# Altium schematic sheet MCU.SchDoc: Bluetooth Gateway
size A; CheckedBy: QUOCTHANG; DrawnBy: DONGKHOA; Revision: V1.0.0; SheetNumber: 6; SheetTotal: 10
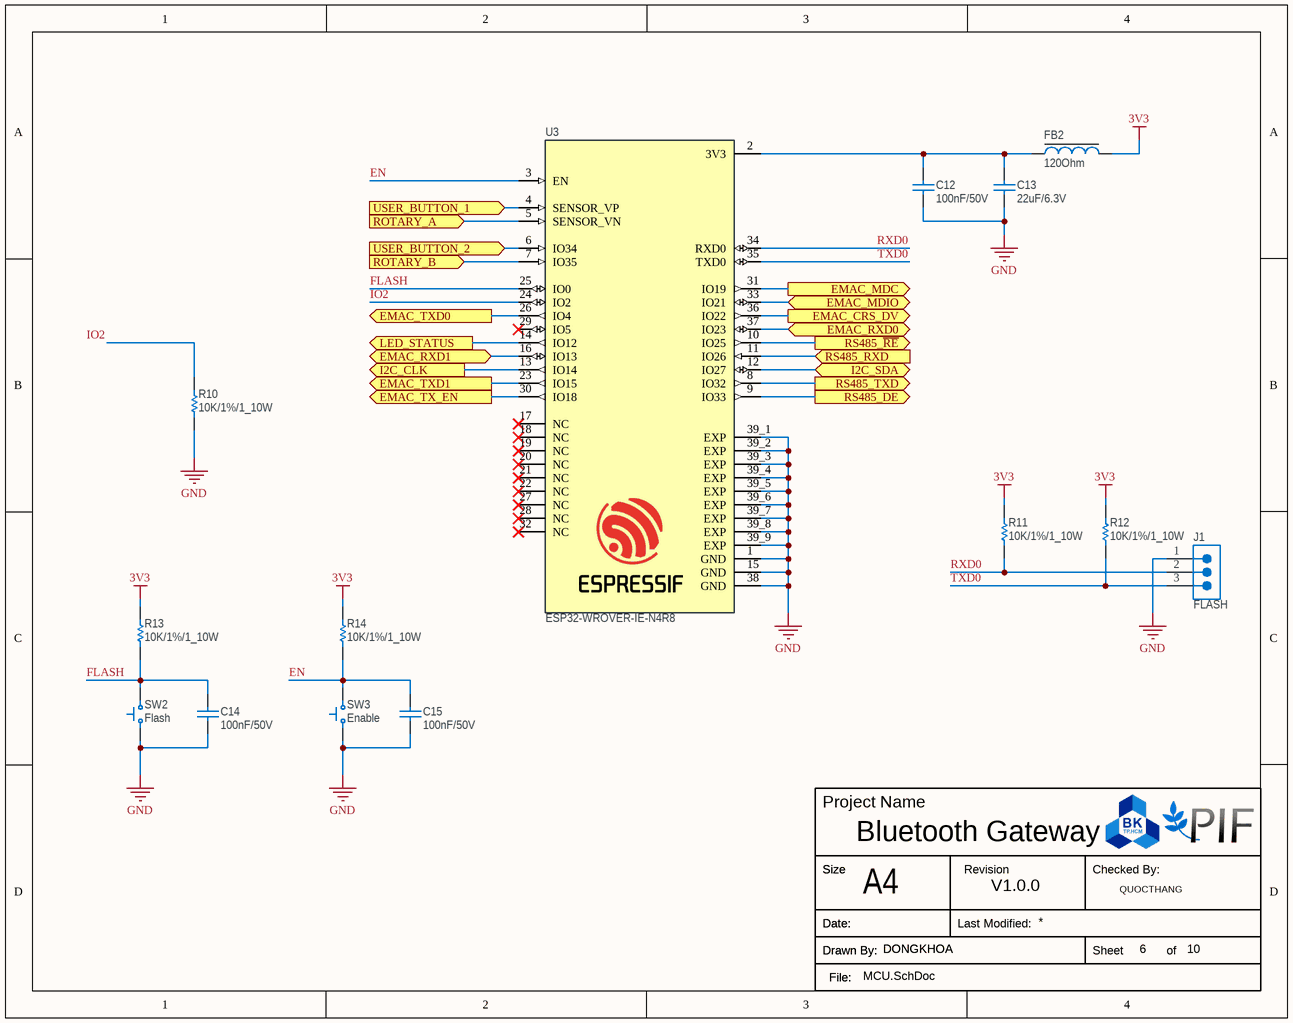
[diagram p0: MCU.SchDoc]

## Parts
C12  100nF/50V  [CAP_0805]
C13  22uF/6.3V  [CAP_0805]
C14  100nF/50V  [CAP_0603]
C15  100nF/50V  [CAP_0603]
FB2  120Ohm  [Ferrite_Bead_0805]
J1  FLASH  [Header_2.54mm_3P]
R10  10K/1%/1_10W  [Resistor_0603]
R11  10K/1%/1_10W  [Resistor_0603]
R12  10K/1%/1_10W  [Resistor_0603]
R13  10K/1%/1_10W  [Resistor_0603]
R14  10K/1%/1_10W  [Resistor_0603]
SW2  Flash  [Button_3x4mm_SMD_2P]
SW3  Enable  [Button_3x4mm_SMD_2P]
U3  ESP32-WROVER-IE-N4R8  [XCVR_ESP32-WROVER-IE-N4R8]

## Ports
EMAC_CRS_DV (out, see Overview_Schematic[5B], Ethernet[7B]), EMAC_MDC (out, see Overview_Schematic[5B], Ethernet[7B]), EMAC_MDIO (bidir, see Overview_Schematic[5B], Ethernet[7B]), EMAC_RXD0 (bidir, see Overview_Schematic[5B], Ethernet[7A]), EMAC_RXD1 (bidir, see Overview_Schematic[5B], Ethernet[7A]), EMAC_TX_EN (out, see Overview_Schematic[5B], Ethernet[7A]), EMAC_TXD0 (out, see Overview_Schematic[5B], Ethernet[7A]), EMAC_TXD1 (out, see Overview_Schematic[5B], Ethernet[7A]), I2C_CLK (out, see Overview_Schematic[4B], Display[2C]), I2C_SDA (bidir, see Overview_Schematic[4B], Display[2C]), LED_STATUS (out, see Overview_Schematic[4C], Interface[2B]), ROTARY_A (in, see Overview_Schematic[4C], Interface[1A]), ROTARY_B (in, see Overview_Schematic[4C], Interface[1A]), RS485_DE (out, see Overview_Schematic[5C], UART_RS485[1B]), RS485_RXD (in, see Overview_Schematic[5C], UART_RS485[1B]), RS485_TXD (out, see Overview_Schematic[5C], UART_RS485[1B]), RS485_~{RE} (out, see Overview_Schematic[5C], UART_RS485[1B]), USER_BUTTON_1 (in, see Overview_Schematic[4C], Interface[3A]), USER_BUTTON_2 (in, see Overview_Schematic[4C], Interface[2A])

## Nets
3V3: FB2.2 R11.2 R12.2 R13.2 R14.2
GND: C12.1 C13.1 C14.1 C15.1 J1.1 R10.1 SW2.1 SW3.1 U3.1(GND) U3.15(GND) U3.38(GND) U3.39_1(EXP) U3.39_2(EXP) U3.39_3(EXP) U3.39_4(EXP) U3.39_5(EXP) U3.39_6(EXP) U3.39_7(EXP) U3.39_8(EXP) U3.39_9(EXP)
EMAC_CRS_DV: U3.36(IO22) ; port EMAC_CRS_DV
EMAC_MDC: U3.31(IO19) ; port EMAC_MDC
EMAC_MDIO: U3.33(IO21) ; port EMAC_MDIO
EMAC_RXD0: U3.37(IO23) ; port EMAC_RXD0
EMAC_RXD1: U3.16(IO13) ; port EMAC_RXD1
EMAC_TX_EN: U3.30(IO18) ; port EMAC_TX_EN
EMAC_TXD0: U3.26(IO4) ; port EMAC_TXD0
EMAC_TXD1: U3.23(IO15) ; port EMAC_TXD1
EN: C15.2 R14.1 SW3.2 U3.3(EN)
FLASH: C14.2 R13.1 SW2.2 U3.25(IO0)
I2C_CLK: U3.13(IO14) ; port I2C_CLK
I2C_SDA: U3.12(IO27) ; port I2C_SDA
IO2: R10.2 U3.24(IO2)
LED_STATUS: U3.14(IO12) ; port LED_STATUS
ROTARY_A: U3.5(SENSOR_VN) ; port ROTARY_A
ROTARY_B: U3.7(IO35) ; port ROTARY_B
RS485_DE: U3.9(IO33) ; port RS485_DE
RS485_~{RE}: U3.10(IO25) ; port RS485_~{RE}
RS485_RXD: U3.11(IO26) ; port RS485_RXD
RS485_TXD: U3.8(IO32) ; port RS485_TXD
RXD0: J1.2 R11.1 U3.34(RXD0)
TXD0: J1.3 R12.1 U3.35(TXD0)
USER_BUTTON_1: U3.4(SENSOR_VP) ; port USER_BUTTON_1
USER_BUTTON_2: U3.6(IO34) ; port USER_BUTTON_2
NetC12_2: C12.2 C13.2 FB2.1 U3.2(3V3)

Not connected (* = marked no-connect by the designer): U3 17(NC)* 18(NC)* 19(NC)* 20(NC)* 21(NC)* 22(NC)* 27(NC)* 28(NC)* 29(IO5)* 32(NC)*

## Notes on the sheet
- Project Name
- Size
- A4
- Revision
- Checked By:
- Drawn By:
- Date:
- File:
- Last Modified:
- Sheet
- of

## Library data of the parts
C12 = Ceramic_Cap_100nF_50V_0805: CAP, size 0805, 100nF, 50V; Supply Part Number: Tụ Gốm 0805 100nF (0.1uF) 50V; Supply Name: Thegioiic; Datasheet: *; Supply URL: https://www.thegioiic.com/tu-gom-0805-100nf-0-1uf-50v
C13 = Ceramic_Cap_22uF_6.3V_0805: CAP, size 0805, 22uF, 6.3V; Supply Part Number: Tụ Gốm 0805 22uF 6.3V; Supply Name: Thegioiic; Datasheet: *; Supply URL: https://www.thegioiic.com/tu-gom-0805-22uf-6-3v
C14 C15 = Ceramic_Cap_100nF_50V_0603: CAP, size 0603, 100nF, 50V; Supply Part Number: Tụ Gốm 0603 100nF (0.1uF) 50V; Supply Name: Thegioiic; Datasheet: *; Supply URL: https://www.thegioiic.com/tu-gom-0603-100nf-0-1uf-50v
FB2 = Ferrite_Bead_120Ohm_2A_0805: Ferrite Bead, size 0805, 120Ohm, 2A; Supply Part Number: CBW201209U121T Ferrite Beads 2A 120 Ohm 0805; Supply Name: Thegioiic; Supply URL: https://www.thegioiic.com/cbw201209u121t-ferrite-beads-2a-120-ohm-0805
J1 = Header_2.54mm_3P: Hàng Rào Đực Đơn 2.54mm 40 Chân 1 Hàng Cao 11.2mm Xuyên Lỗ; Supply Name: Thegioiic; Supply Part Number: Hàng Rào Đực Đơn 2.54mm 40 Chân 1 Hàng Cao 11.2mm Xuyên Lỗ; Supply URL: https://www.thegioiic.com/hang-rao-duc-don-2-54mm-40-chan-1-hang-cao-11-2mm-xuyen-lo
R10-R14 = Res_10K_0603_1%: Resistor 0603 10KOhm 1% 1_10W; Supply Part Number: Điện Trở 10 KOhm 0603 1%; Supply Name: Thegioiic; Supply URL: https://www.thegioiic.com/dien-tro-10-kohm-0603-1-
SW2 SW3 = Button_SMD_3x4mm_2P: Supply Part Number: Nút Nhấn 3x4mm Cao 2.5mm 2 Chân SMD; Supply Name: Thegioiic; Datasheet: *; Supply URL: https://www.thegioiic.com/nut-nhan-3x4mm-cao-2-5mm-2-chan-smd
U3 = ESP32-WROVER-IE-N4R8: Bluetooth, WiFi 802.11b/g/n, Bluetooth v4.2 +EDR Transceiver Module 2.4GHz ~ 2.5GHz PCB Trace Surface Mount; Supply Part Number: ESP32-WROVER-IE-N4R8 Module WiFi Bluetooth 4MB Flash, 8MB PSRAM, 2.4GHz; Supply Name: Thegioiic; Datasheet: https://www.espressif.com/sites/default/files/documentation/esp32-wrover-e_esp32-wrover-ie_datasheet_en.pdf; Supply URL: https://www.thegioiic.com/esp32-wrover-ie-n4r8-module-wifi-bluetooth-4mb-flash-8mb-psram-2-4ghz